# Altium project ADC_shield.PrjPcb
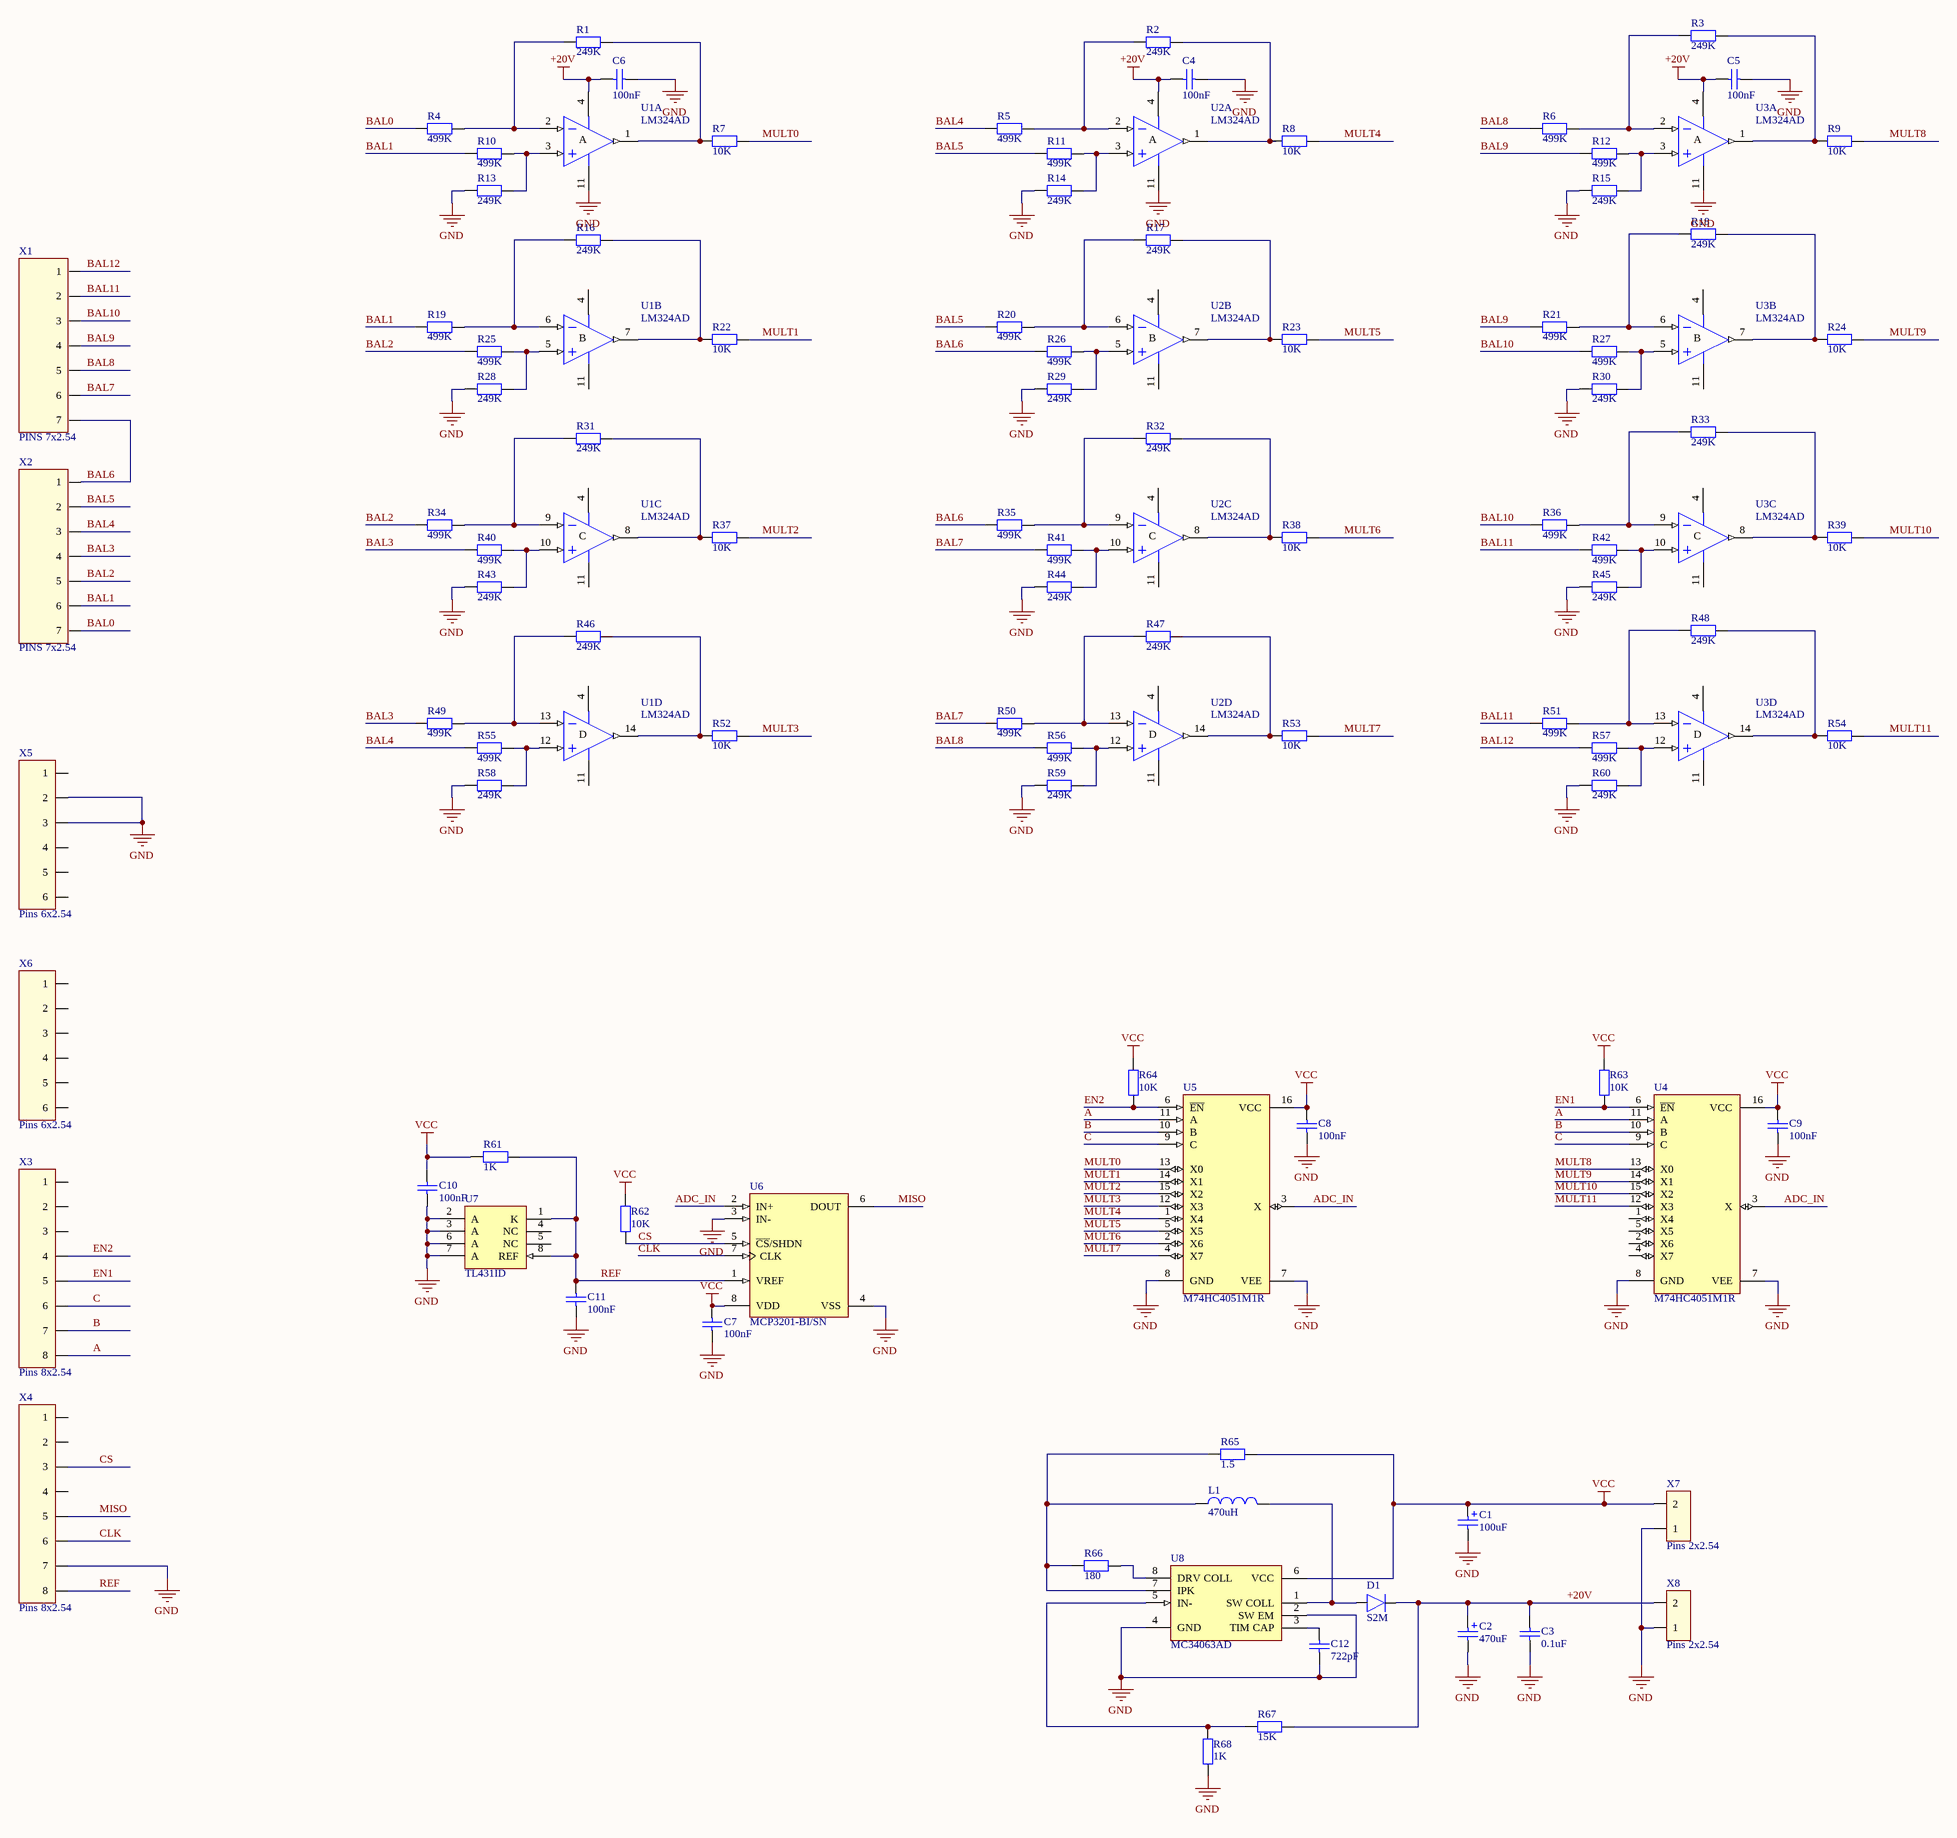
[diagram p0: ADC_Shield.SchDoc]
1 sheet, 98 parts. Net scope: global (net labels, ports and power ports of the same name join across sheets).
Board file: ADC_Shield_lut.PcbDoc

## Sheet ADC_Shield.SchDoc
size A1

### Parts
C1  100uF  [CAP_EL_SMD_6.3mm]
C2  470uF  [Cap_El_SMD_10mm]
C3  0.1uF  [C0805]
C4  100nF  [C0805]
C5  100nF  [C0805]
C6  100nF  [C0805]
C7  100nF  [C0805]
C8  100nF  [C0805]
C9  100nF  [C0805]
C10  100nF  [C0805]
C11  100nF  [C0805]
C12  722pF  [C0805]
D1  S2M  [SMB_DIODE]
L1  470uH  [L1812]
R1  249K  [R0805]
R2  249K  [R0805]
R3  249K  [R0805]
R4  499K  [R0805]
R5  499K  [R0805]
R6  499K  [R0805]
R7  10K  [R0805]
R8  10K  [R0805]
R9  10K  [R0805]
R10  499K  [R0805]
R11  499K  [R0805]
R12  499K  [R0805]
R13  249K  [R0805]
R14  249K  [R0805]
R15  249K  [R0805]
R16  249K  [R0805]
R17  249K  [R0805]
R18  249K  [R0805]
R19  499K  [R0805]
R20  499K  [R0805]
R21  499K  [R0805]
R22  10K  [R0805]
R23  10K  [R0805]
R24  10K  [R0805]
R25  499K  [R0805]
R26  499K  [R0805]
R27  499K  [R0805]
R28  249K  [R0805]
R29  249K  [R0805]
R30  249K  [R0805]
R31  249K  [R0805]
R32  249K  [R0805]
R33  249K  [R0805]
R34  499K  [R0805]
R35  499K  [R0805]
R36  499K  [R0805]
R37  10K  [R0805]
R38  10K  [R0805]
R39  10K  [R0805]
R40  499K  [R0805]
R41  499K  [R0805]
R42  499K  [R0805]
R43  249K  [R0805]
R44  249K  [R0805]
R45  249K  [R0805]
R46  249K  [R0805]
R47  249K  [R0805]
R48  249K  [R0805]
R49  499K  [R0805]
R50  499K  [R0805]
R51  499K  [R0805]
R52  10K  [R0805]
R53  10K  [R0805]
R54  10K  [R0805]
R55  499K  [R0805]
R56  499K  [R0805]
R57  499K  [R0805]
R58  249K  [R0805]
R59  249K  [R0805]
R60  249K  [R0805]
R61  1K  [R0805]
R62  10K  [R0805]
R63  10K  [R0805]
R64  10K  [R0805]
R65  1.5  [R0805]
R66  180  [R0805]
R67  15K  [R0805]
R68  1K  [R0805]
U1  LM324AD  [SO14_N]  (parts A,B,C,D of 4)
U2  LM324AD  [SO14_N]  (parts A,B,C,D of 4)
U3  LM324AD  [SO14_N]  (parts A,B,C,D of 4)
U4  M74HC4051M1R  [SO16_N]
U5  M74HC4051M1R  [SO16_N]
U6  MCP3201-BI/SN  [SO8]
U7  TL431ID  [SO8_N]
U8  MC34063AD  [751-05_N]
X1  PINS 7x2.54  [PINS 7X2.54R angle]
X2  PINS 7x2.54  [PINS 7X2.54R angle]
X3  Pins 8x2.54  [Pins 8x2.54]
X4  Pins 8x2.54  [Pins 8x2.54]
X5  Pins 6x2.54  [Pins 6x2.54]
X6  Pins 6x2.54  [Pins 6x2.54]
X7  Pins 2x2.54  [Pins 2x2.54]
X8  Pins 2x2.54  [Pins 2x2.54]

### Nets
+20V: C2.1 C3.2 C4.1 C5.1 C6.1 D1.2 R67.2 U1.4(V+) U2.4(V+) U3.4(V+) X8.2
GND: C1.2 C2.2 C3.1 C4.2 C5.2 C6.2 C7.1 C8.1 C9.1 C10.1 C11.1 C12.1 R13.1 R14.1 R15.1 R28.1 R29.1 R30.1 R43.1 R44.1 R45.1 R58.1 R59.1 R60.1 R68.1 U1.11(V-) U2.11(V-) U3.11(V-) U4.7(VEE) U4.8(GND) U5.7(VEE) U5.8(GND) U6.3(IN-) U6.4(VSS) U7.2(A) U7.3(A) U7.6(A) U7.7(A) U8.2(SW_EM) U8.4(GND) X4.7 X5.2 X5.3 X7.1 X8.1
VCC: C1.1 C7.2 C8.2 C9.2 C10.2 R61.1 R62.2 R63.2 R64.2 R65.1 U4.16(VCC) U5.16(VCC) U6.8(VDD) U8.6(VCC) X7.2
A: U4.11(A) U5.11(A) X3.8
ADC_IN: U4.3(X) U5.3(X) U6.2(IN+)
B: U4.10(B) U5.10(B) X3.7
BAL0: R4.1 X2.7
BAL1: R10.1 R19.1 X2.6
BAL2: R25.1 R34.1 X2.5
BAL3: R40.1 R49.1 X2.4
BAL4: R5.1 R55.1 X2.3
BAL5: R11.1 R20.1 X2.2
BAL6: R26.1 R35.1 X1.7 X2.1
BAL7: R41.1 R50.1 X1.6
BAL8: R6.1 R56.1 X1.5
BAL9: R12.1 R21.1 X1.4
BAL10: R27.1 R36.1 X1.3
BAL11: R42.1 R51.1 X1.2
BAL12: R57.1 X1.1
C: U4.9(C) U5.9(C) X3.6
CLK: U6.7(CLK) X4.6
CS: R62.1 U6.5(~{CS}/SHDN) X4.3
EN1: R63.1 U4.6(~{EN}) X3.5
EN2: R64.1 U5.6(~{EN}) X3.4
MISO: U6.6(DOUT) X4.5
MULT0: R7.2 U5.13(X0)
MULT1: R22.2 U5.14(X1)
MULT2: R37.2 U5.15(X2)
MULT3: R52.2 U5.12(X3)
MULT4: R8.2 U5.1(X4)
MULT5: R23.2 U5.5(X5)
MULT6: R38.2 U5.2(X6)
MULT7: R53.2 U5.4(X7)
MULT8: R9.2 U4.13(X0)
MULT9: R24.2 U4.14(X1)
MULT10: R39.2 U4.15(X2)
MULT11: R54.2 U4.12(X3)
REF: C11.2 R61.2 U6.1(VREF) U7.1(K) U7.8(REF) X4.8
NetC12_2: C12.2 U8.3(TIM_CAP)
NetD1_1: D1.1 L1.2 U8.1(SW_COLL)
NetL1_1: L1.1 R65.2 R66.2 U8.7(IPK)
NetR1_1: R1.1 R4.2 U1.2(IN-)
NetR1_2: R1.2 R7.1 U1.1(OUT)
NetR2_1: R2.1 R5.2 U2.2(IN-)
NetR2_2: R2.2 R8.1 U2.1(OUT)
NetR3_1: R3.1 R6.2 U3.2(IN-)
NetR3_2: R3.2 R9.1 U3.1(OUT)
NetR10_2: R10.2 R13.2 U1.3(IN+)
NetR11_2: R11.2 R14.2 U2.3(IN+)
NetR12_2: R12.2 R15.2 U3.3(IN+)
NetR16_1: R16.1 R19.2 U1.6(IN-)
NetR16_2: R16.2 R22.1 U1.7(OUT)
NetR17_1: R17.1 R20.2 U2.6(IN-)
NetR17_2: R17.2 R23.1 U2.7(OUT)
NetR18_1: R18.1 R21.2 U3.6(IN-)
NetR18_2: R18.2 R24.1 U3.7(OUT)
NetR25_2: R25.2 R28.2 U1.5(IN+)
NetR26_2: R26.2 R29.2 U2.5(IN+)
NetR27_2: R27.2 R30.2 U3.5(IN+)
NetR31_1: R31.1 R34.2 U1.9(IN-)
NetR31_2: R31.2 R37.1 U1.8(OUT)
NetR32_1: R32.1 R35.2 U2.9(IN-)
NetR32_2: R32.2 R38.1 U2.8(OUT)
NetR33_1: R33.1 R36.2 U3.9(IN-)
NetR33_2: R33.2 R39.1 U3.8(OUT)
NetR40_2: R40.2 R43.2 U1.10(IN+)
NetR41_2: R41.2 R44.2 U2.10(IN+)
NetR42_2: R42.2 R45.2 U3.10(IN+)
NetR46_1: R46.1 R49.2 U1.13(IN-)
NetR46_2: R46.2 R52.1 U1.14(OUT)
NetR47_1: R47.1 R50.2 U2.13(IN-)
NetR47_2: R47.2 R53.1 U2.14(OUT)
NetR48_1: R48.1 R51.2 U3.13(IN-)
NetR48_2: R48.2 R54.1 U3.14(OUT)
NetR55_2: R55.2 R58.2 U1.12(IN+)
NetR56_2: R56.2 R59.2 U2.12(IN+)
NetR57_2: R57.2 R60.2 U3.12(IN+)
NetR66_1: R66.1 U8.8(DRV_COLL)
NetR67_1: R67.1 R68.2 U8.5(IN-)

Not connected (* = marked no-connect by the designer): U4 1(X4) 2(X6) 4(X7) 5(X5); U7 4(NC) 5(NC); X3 1 2 3; X4 1 2 4; X5 1 4 5 6; X6 1 2 3 4 5 6

### Notes on the sheet
- (in symbol LM324AD, part A) A
- (in symbol LM324AD, part B) B
- (in symbol LM324AD, part C) C
- (in symbol LM324AD, part D) D

### Library data of the parts
C1 C2 = Cond_polar
C3-C12 = Condensator
D1 = Diod
L1 = Inductance
R1-R68 = Resistor
U1-U3 = LM324AD: Low-Power Quad Operational Amplifier; Published: 24-Aug-2001; LatestRevisionDate: 13-Apr-2006; LatestRevisionNote: IPC-7351 Footprint Added.; DatasheetVersion: Nov-1997; PackageVersion: Sep-1998; PackageReference: SO14; Publisher: Altium Limited; PackageDescription: 14-Pin Small Outline Integrated Circuit 1.27 mm Pitch; Code_IPC: SOIC127P600-14; ComponentLink1Description: Manufacturer Link; ComponentLink1URL: http://www.st.com/; ComponentLink2Description: Datasheet; ComponentLink2URL: http://www.st.com/stonline/products/literature/ds/4797/lm224a.pdf
U4 U5 = M74HC4051M1R: Analog Multiplexer/Demultiplexer Single 8-Channel; Published: 8-Jun-2000; LatestRevisionDate: 13-Apr-2006; LatestRevisionNote: IPC-7351 Footprint Added.; DatasheetVersion: Oct-1993; PackageVersion: May-1998; PackageReference: SO16; Publisher: Altium Limited; PackageDescription: 16-Pin Small Outline Integrated Circuit 1.27 mm Pitch; Code_IPC: SOIC127P600-16; ComponentLink1Description: Manufacturer Link; ComponentLink1URL: http://www.st.com/; ComponentLink2Description: Datasheet; ComponentLink2URL: http://www.st.com/stonline/products/literature/ds/1966/m74hc4051.pdf
U7 = TL431ID: Programmable Voltage Reference; Published: 24-Aug-2001; LatestRevisionDate: 13-Apr-2006; LatestRevisionNote: IPC-7351 Footprint Added.; DatasheetVersion: Nov-1998; PackageVersion: Dec-2002; PackageReference: SO8; Publisher: Altium Limited; PackageDescription: 8-Pin Small Outline Integrated Circuit 1.27 mm Pitch; Code_JEDEC: MS-012-AA; Code_IPC: SOIC127P600-8; ComponentLink1Description: Manufacturer Link; ComponentLink1URL: http://www.st.com/; ComponentLink2Description: Datasheet; ComponentLink2URL: http://www.st.com/stonline/products/literature/ds/4467/tl431.pdf
U8 = MC34063AD: DC-to-DC Converter Control Circuit; Published: 15-Apr-2002; LatestRevisionDate: 13-Apr-2006; LatestRevisionNote: IPC-7351 Footprint Added.; DatasheetVersion: 1996; PackageVersion: 1998; PackageReference: 751-05; Publisher: Altium Limited; PackageDescription: 8-Pin Small Outline Integrated Circuit 1.27 mm Pitch; Code_JEDEC: MS-012-AA; Code_IPC: SOIC127P600-8; ComponentLink1Description: Manufacturer Link; ComponentLink1URL: http://www.onsemi.com/site/products/taxonomy/0,4438,503,00.html; ComponentLink2Description: Datasheet; ComponentLink2URL: http://www.onsemi.com/pub/Collateral/MC34063A-D.PDF